# EAGLE design Hub_Teensy3_ElecImp (EAGLE 6.2)
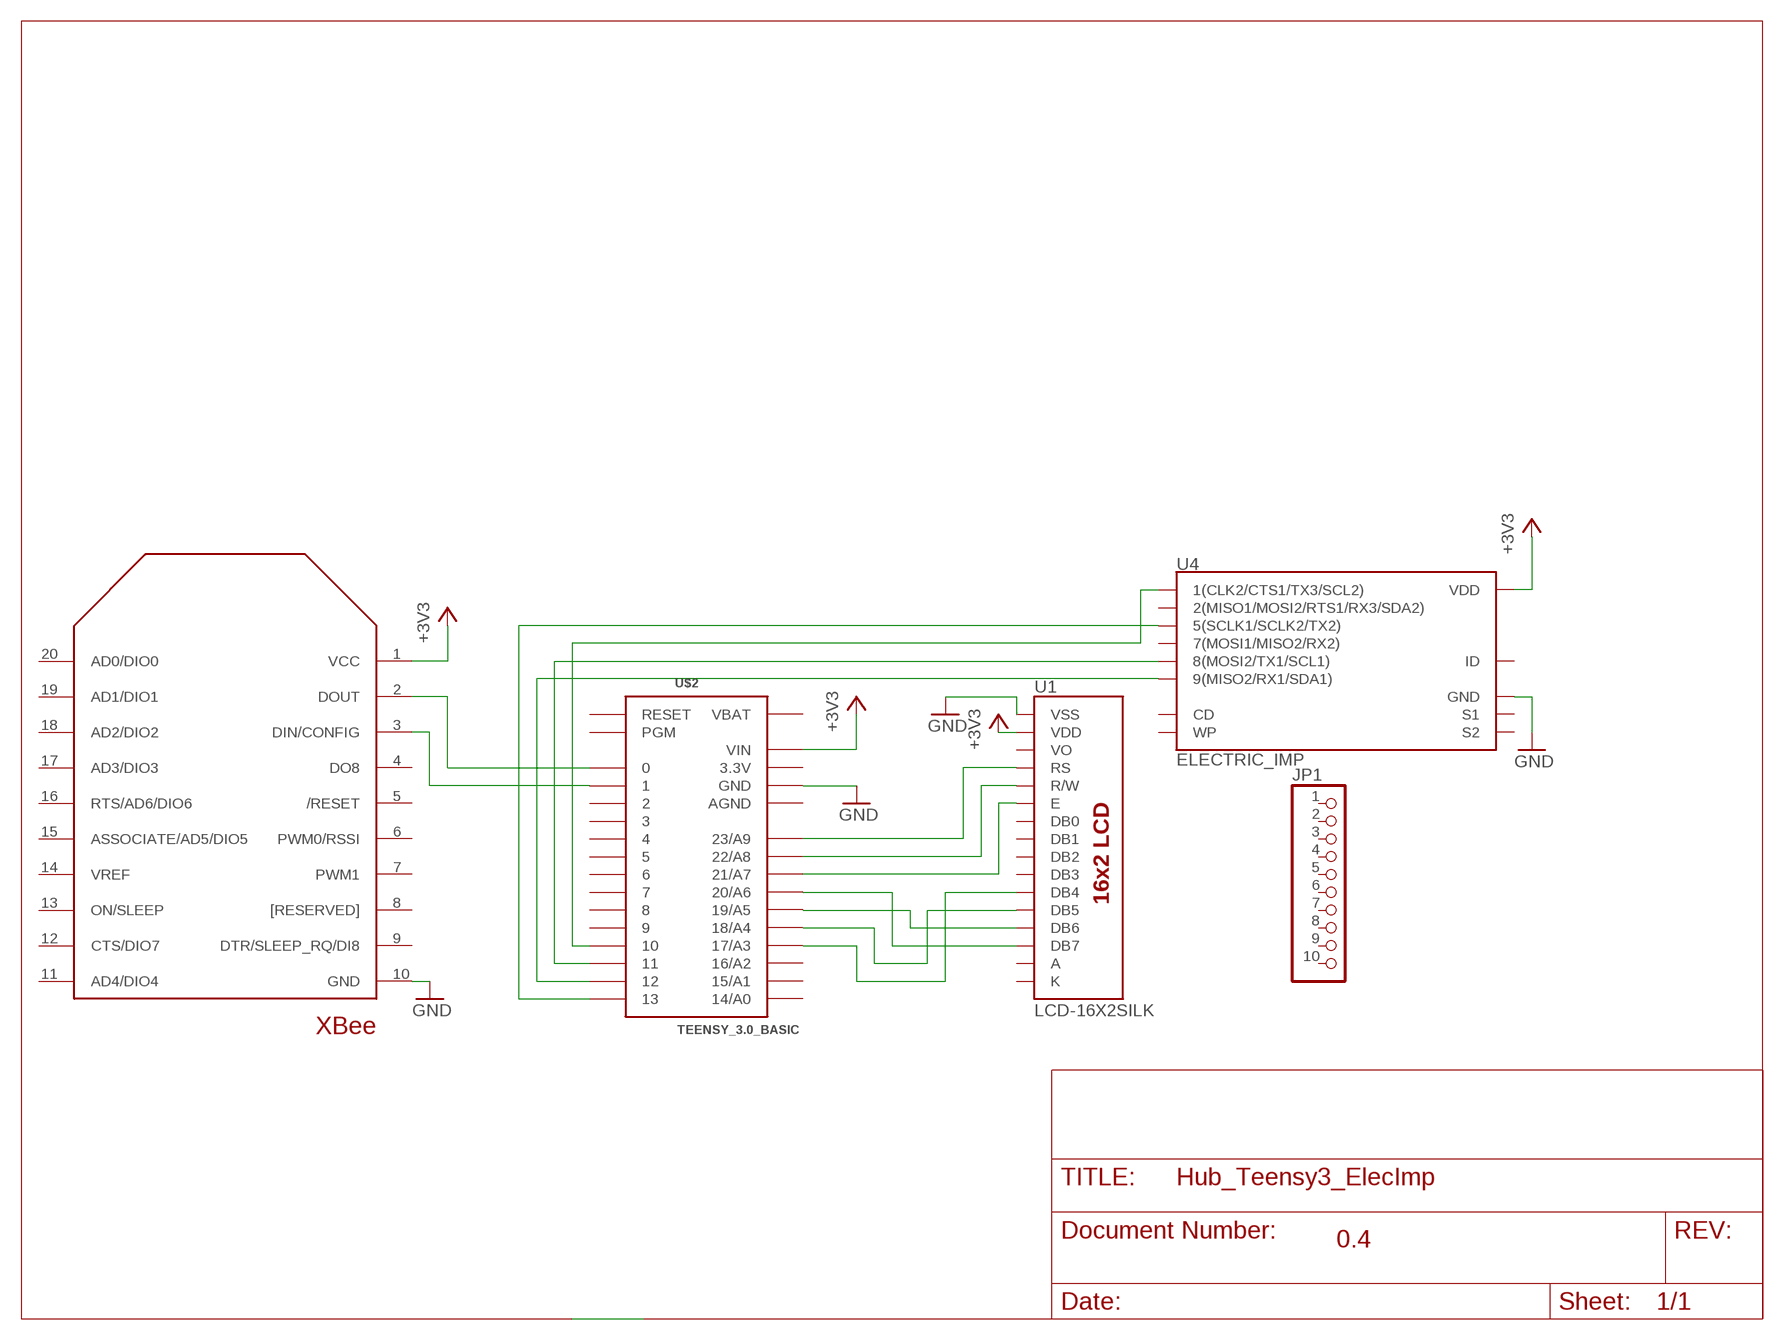
[diagram p0: schematic, sheet 1]

## Parts
JP1  PINHD-1X10  [1X10]
U1  LCD-16X2SILK  [LCD-16X2]
U4  ELECTRIC_IMP  [SD_MMC_SOCKET]
U$1  XBEE  [XBEE]
U$2  TEENSY_3.0_BASIC  [TEENSY_3.0_BASIC]

## Nets
+3V3: U1.2(VDD) U4.4(VDD) U$1.1(VCC) U$2.VIN
GND: U1.1(VSS) U4.3(GND) U$1.10(GND) U$2.GND U$2.GND1(GND)
N$1: U1.14(DB7) U$2.20/A6
N$2: U1.13(DB6) U$2.19/A5
N$3: U1.12(DB5) U$2.18/A4
N$4: U1.6(E) U$2.21/A7
N$5: U1.4(RS) U$2.23/A9
N$6: U1.5(R/W) U$2.22/A8
N$8: U4.5(5(SCLK1/SCLK2/TX2)) U$2.13
N$9: U4.1(1(CLK2/CTS1/TX3/SCL2)) U$2.10
N$10: U1.11(DB4) U$2.17/A3
N$11: U4.9(9(MISO2/RX1/SDA1)) U$2.12
N$12: U$1.3(DIN/CONFIG) U$2.1
N$13: U4.8(8(MOSI2/TX1/SCL1)) U$2.11
N$17: U$1.2(DOUT) U$2.0
Unconnected: JP1.1 JP1.2 JP1.3 JP1.4 JP1.5 JP1.6 JP1.7 JP1.8 JP1.9 JP1.10 U1.3(VO) U1.7(DB0) U1.8(DB1) U1.9(DB2) U1.10(DB3) U4.2(2(MISO1/MOSI2/RTS1/RX3/SDA2)) U4.6(ID) U4.7(7(MOSI1/MISO2/RX2)) U4.CD U4.S1 U4.S2 U4.WP U$1.4(DO8) U$1.5(/RESET) U$1.6(PWM0/RSSI) U$1.7(PWM1) U$1.8([RESERVED]) U$1.9(DTR/SLEEP_RQ/DI8) U$1.11(AD4/DIO4) U$1.12(CTS/DIO7) U$1.13(ON/SLEEP) U$1.14(VREF) U$1.15(ASSOCIATE/AD5/DIO5) U$1.16(RTS/AD6/DIO6) U$1.17(AD3/DIO3) U$1.18(AD2/DIO2) U$1.19(AD1/DIO1) U$1.20(AD0/DIO0) U$2.2 U$2.3 U$2.4 U$2.5 U$2.6 U$2.7 U$2.8 U$2.9 U$2.14/A0 U$2.15/A1 U$2.16/A2 U$2.PGM U$2.RESET

## Notes on the sheet
- 0.4

## Power pins joined to a net without a drawn wire
3.3V: U$2.3.3V U$2.3.3V1(3.3V)
A: U1.15(A)
AGND: U$2.AGND
K: U1.16(K)
VBAT: U$2.VBAT

## Library data of the parts
JP1 = pinhead:PINHD-1X10: PIN HEADER
U1 = SparkFun-Displays:LCD-16X2: Standard text-only 16x2 parallel input LCD
U4 = SparkFun-RF:ELECTRIC_IMP: Electric Imp SD Socket This symbol matches the Electric Imp <https://www.sparkfun.com/products/11395> pinout to a 4UCONN SD MMC connector. The 4UCONN part number is 19646 <http://www.4uconnector.com/online/Itemadrawing.asp?fldseries=19646&seriesno_a=12>. See this part in action on the Electric Imp Breakout <https://www.sparkfun.com/products/11400>.
U$1 = CEDT:XBEE
U$2 = Teensy3-2.0:TEENSY_3.0_BASIC: Basic Teensy 3.0 with none of the 'inner' pins enabled. See '+4', 'AllAnalogPins", and 'AllPins' packages for additional pin holes, as needed.

## Board
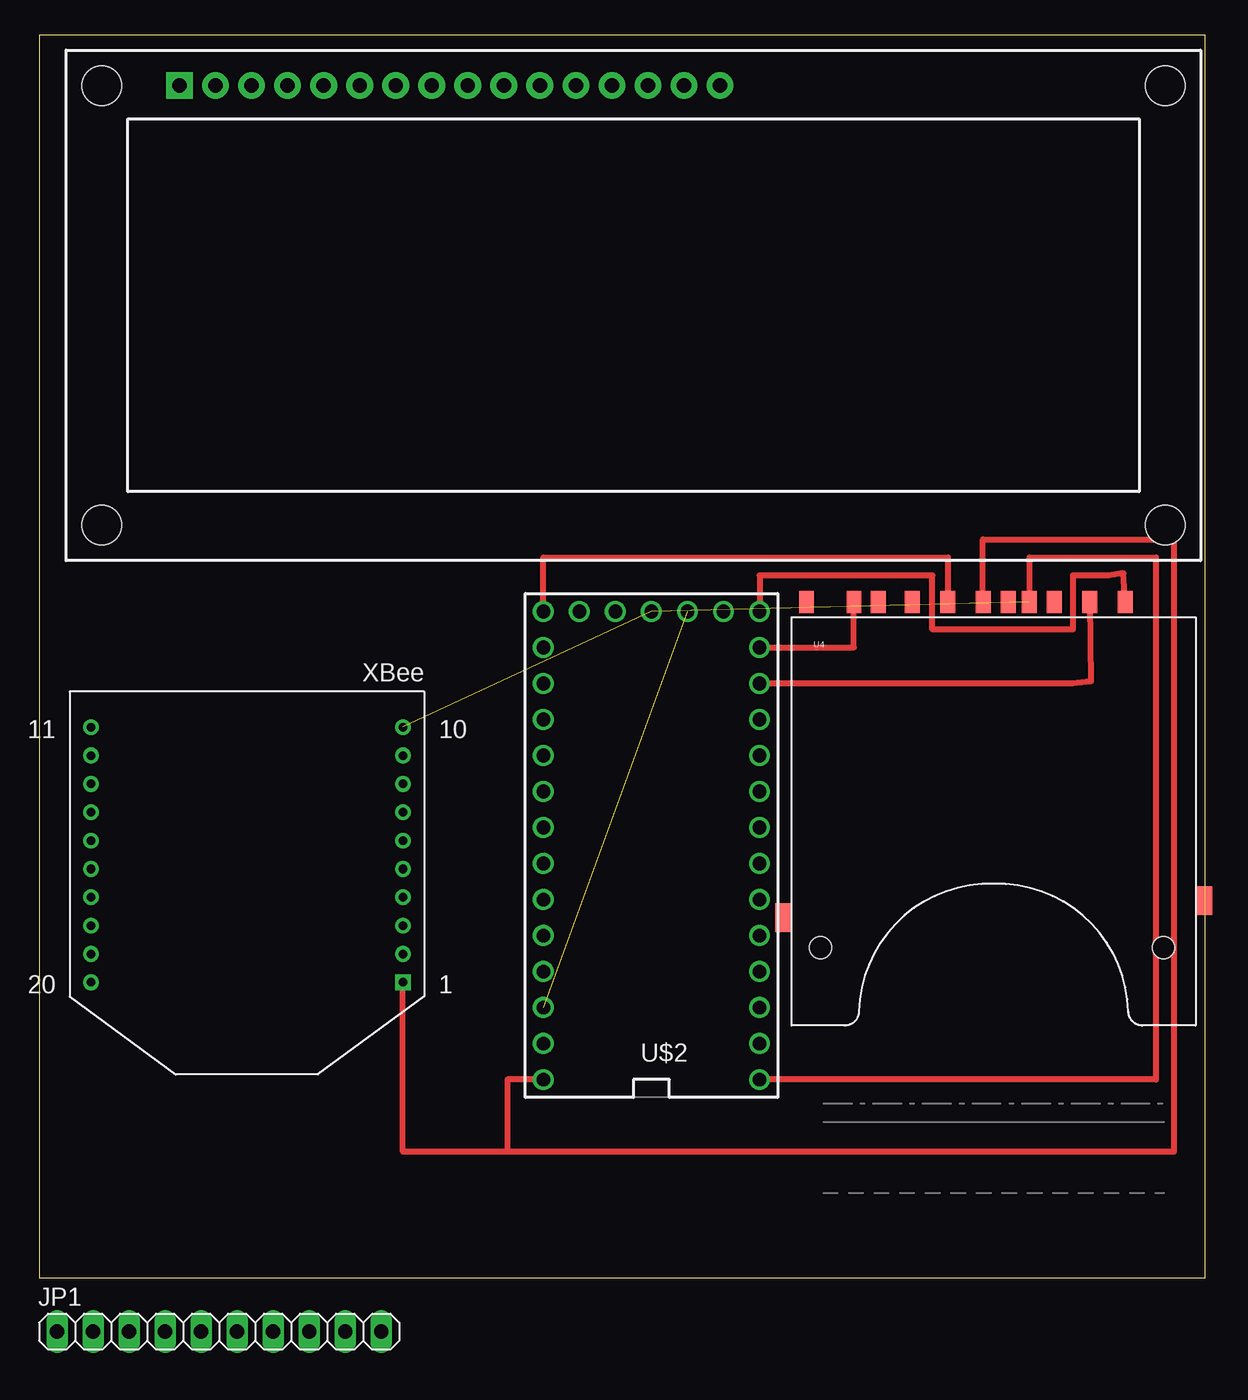
[diagram p1: board, top side]
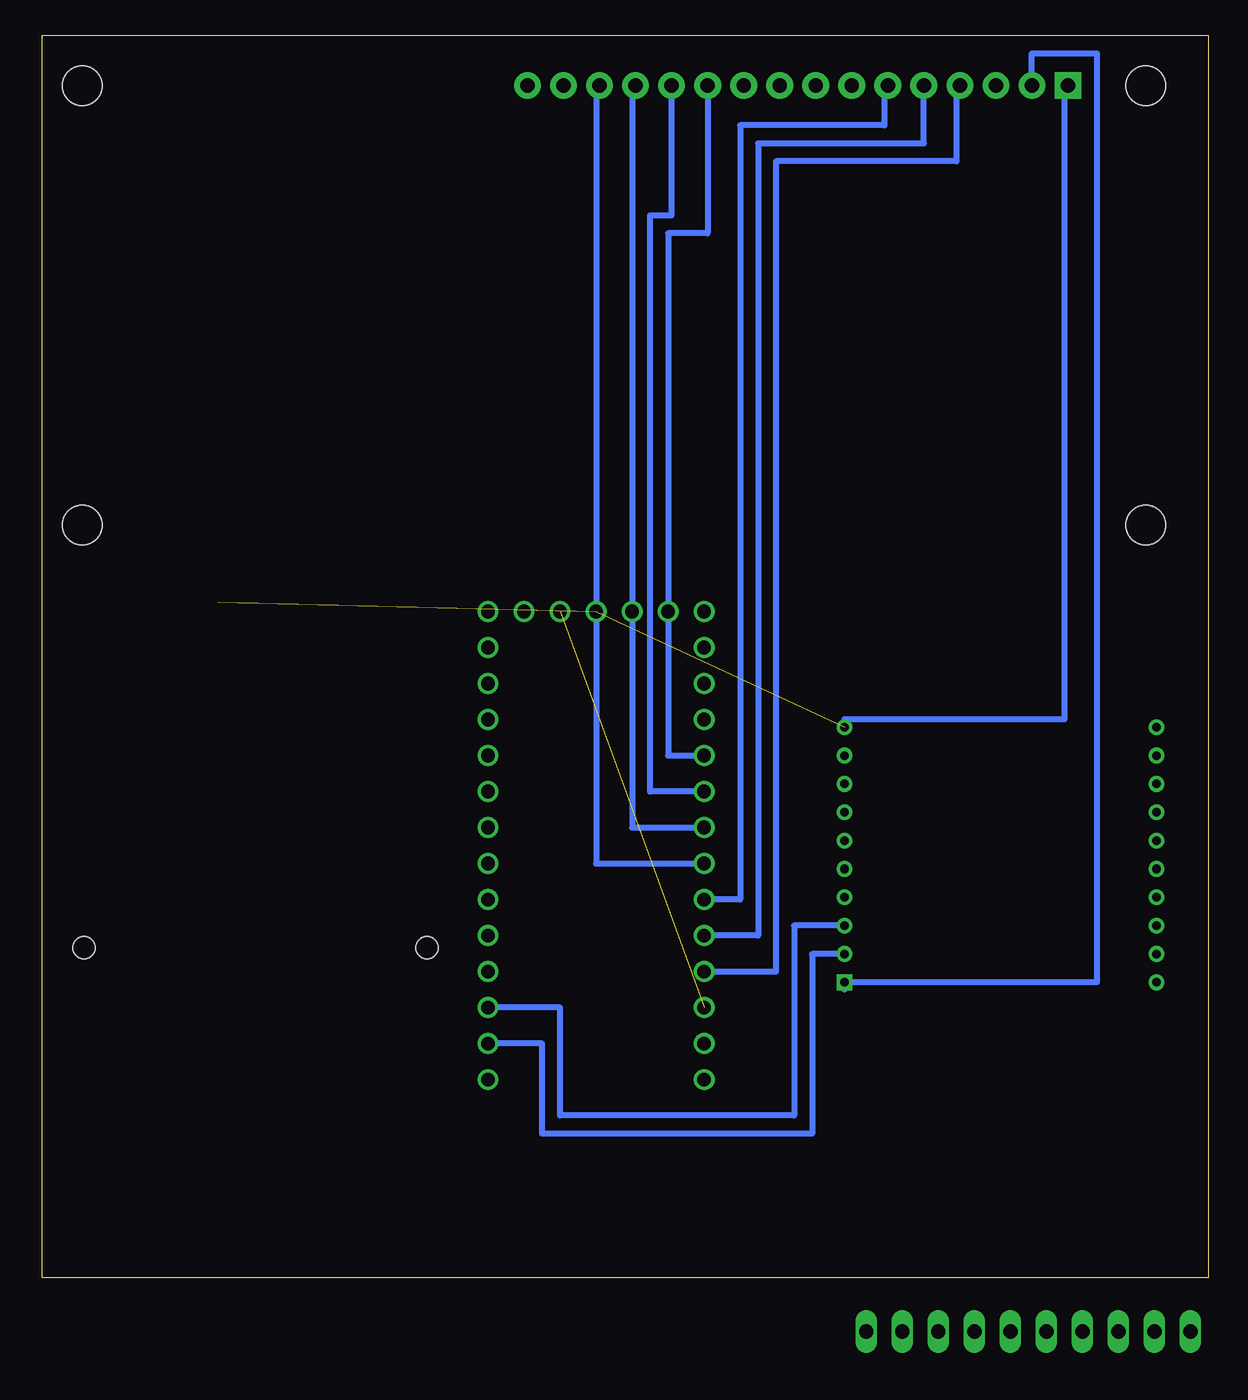
[diagram p2: board, bottom side, seen from below]

Size 82.22 x 87.62 mm. Coordinates in mm from the lower left corner, seen from the top.
Outline: 0,0 82.22,0 82.22,87.62 0,87.62 0,0
Copper layers (1*16): Top 0.035mm / dielectric 1.5mm / Bottom 0.035mm
Design rules: minimum track width 10mil, minimum drill 24mil, track to track 8mil, track to pad 8mil, pad to pad 8mil, via to via 8mil, smd to smd 8mil, copper to edge 40mil, drill to drill 8mil, minimum pad ring 10mil, minimum via ring 8mil, stop-mask expansion 4mil, vias tented up to drill 0mil, thermal gap 10mil

### Footprints (pad centres in the part's own frame; a part is rotated, then mirrored left to right if it is on the bottom)
1X10 = drill 1.016 long: 1 -11.43,0; 2 -8.89,0; 3 -6.35,0; 4 -3.81,0; 5 -1.27,0; 6 1.27,0; 7 3.81,0; 8 6.35,0; 9 8.89,0; 10 11.43,0
LCD-16X2 = drill 1.016 pad 1.88 square: 1 -32,15.5 | drill 1.016 pad 1.88: 2 -29.46,15.5; 3 -26.92,15.5; 4 -24.38,15.5; 5 -21.84,15.5; 6 -19.3,15.5; 7 -16.76,15.5; 8 -14.22,15.5; 9 -11.68,15.5; 10 -9.14,15.5; 11 -6.6,15.5; 12 -4.06,15.5; 13 -1.52,15.5; 14 1.02,15.5; 15 3.56,15.5; 16 6.1,15.5 | hole 2.8: -37.5,15.5; -37.5,-15.5; 37.5,15.5; 37.5,-15.5
SD_MMC_SOCKET = smd 1.05 x 1.56: 1 6.77,29.87; 2 4.27,29.87; 3 2.52,29.87; 4 -0.73,29.87; 5 -3.23,29.87; 6 -5.73,29.87; 7 -8.15,29.87; 8 -9.85,29.87; 9 9.27,29.87; CD 1.02,29.87; WP -13.2,29.87 | smd 1.2 x 2: S1 -14.8,7.6; S2 14.8,8.8 | hole 1.55: 11.98,5.5; -12.22,5.5
XBEE = drill 0.6 square: 1 0,0 | drill 0.6: 2 0,-2; 3 0,-4; 4 0,-6; 5 0,-8; 6 0,-10; 7 0,-12; 8 0,-14; 9 0,-16; 10 0,-18; 11 22,-18; 12 22,-16; 13 22,-14; 14 22,-12; 15 22,-10; 16 22,-8; 17 22,-6; 18 22,-4; 19 22,-2; 20 22,0
TEENSY_3.0_BASIC = drill 0.965: 0 -7.62,13.97; 1 -7.62,11.43; 2 -7.62,8.89; 3 -7.62,6.35; 3.3V 7.62,11.43; 3.3V1 -2.54,-16.51; 4 -7.62,3.81; 5 -7.62,1.27; 6 -7.62,-1.27; 7 -7.62,-3.81; 8 -7.62,-6.35; 9 -7.62,-8.89; 10 -7.62,-11.43; 11 -7.62,-13.97; 12 -7.62,-16.51; 13 7.62,-16.51; 14/A0 7.62,-13.97; 15/A1 7.62,-11.43; 16/A2 7.62,-8.89; 17/A3 7.62,-6.35; 18/A4 7.62,-3.81; 19/A5 7.62,-1.27; 20/A6 7.62,1.27; 21/A7 7.62,3.81; 22/A8 7.62,6.35; 23/A9 7.62,8.89; AGND 7.62,13.97; GND -7.62,16.51; GND1 0,-16.51; PGM 2.54,-16.51; RESET 5.08,-16.51; VBAT -5.08,-16.51; VIN 7.62,16.51

### Placement (x,y rotation side)
JP1  12.7,-3.81 0 top  (outside the outline)
U1  41.91,68.58 0 top
U4  67.31,17.78 0 top
U$1  25.65,20.83 180 top
U$2  43.18,30.48 180 top

### Tracks (layer width: path | path; a pad name or v marks a point on that pad's centre or on a via)
3.3V  (1 unrouted)
+3V3  (1 unrouted)
  Top 0.406: U$2.VIN 33.02,13.97 33.02,8.89 | 33.02,8.89 25.65,8.89 U$1.1 | U4.4 66.55,47.65 66.55,52.07 80.01,52.07 80.01,8.89 33.02,8.89
  Bottom 0.406: U1.2 12.45,86.36 7.87,86.36 7.87,20.83 U$1.1 25.65,20.32
GND  (2 unrouted)
  Top 0.406: U4.3 69.85,47.65 69.85,50.8 78.74,50.8 78.74,13.97 U$2.GND
  Bottom 0.406: U1.1 10.16,84.08 10.16,39.37 25.65,39.37 U$1.10
N$1
  Bottom 0.406: U1.14 43.18,84.08 43.18,29.21 U$2.20/A6
N$2
  Bottom 0.406: U1.13 40.64,84.08 40.64,31.75 U$2.19/A5
N$3
  Bottom 0.406: U$2.18/A4 39.37,34.29 39.37,74.93 37.85,74.93 U1.12
N$4
  Bottom 0.406: U1.6 22.86,84.08 22.86,81.28 33.02,81.28 33.02,26.67 U$2.21/A7
N$5
  Bottom 0.406: U1.4 17.78,84.08 17.78,78.74 30.48,78.74 30.48,21.59 U$2.23/A9
N$6
  Bottom 0.406: U1.5 20.07,80.01 31.75,80.01 31.75,24.13 U$2.22/A8
N$8
  Top 0.406: U$2.13 35.56,50.8 64.08,50.8 U4.5
N$9
  Top 0.406: U4.1 74.17,42.06 72.9,41.91 U$2.10
N$10
  Bottom 0.406: U1.11 35.31,73.66 38.1,73.66 38.1,36.83 U$2.17/A3
N$11
  Top 0.406: U4.9 76.45,49.68 75.44,49.53 72.9,49.53 72.9,45.72 62.99,45.72 62.99,49.53 50.8,49.53 U$2.12
N$12
  Bottom 0.406: U$1.3 29.21,24.83 29.21,11.43 45.72,11.43 45.72,19.05 U$2.1
N$13
  Top 0.406: U$2.11 57.46,44.45 U4.8
N$17
  Bottom 0.406: U$1.2 27.94,22.83 27.94,10.16 46.99,10.16 46.99,16.51 U$2.0